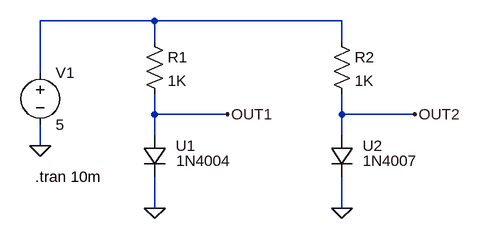
[diagram p0: schematic Diode_1N400x.asc]
Diode_1N400x.asc, the LTspice schematic file:
Version 4.1
SHEET 1 880 680
WIRE 176 80 0 80
WIRE 464 80 176 80
WIRE 176 112 176 80
WIRE 464 112 464 80
WIRE 0 160 0 80
WIRE 176 224 176 192
WIRE 288 224 176 224
WIRE 464 224 464 192
WIRE 576 224 464 224
WIRE 176 256 176 224
WIRE 464 256 464 224
WIRE 0 272 0 240
WIRE 176 368 176 320
WIRE 464 368 464 320
FLAG 176 368 0
FLAG 0 272 0
FLAG 288 224 OUT1
FLAG 464 368 0
FLAG 576 224 OUT2
SYMBOL voltage 0 144 R0
WINDOW 123 0 0 Left 0
WINDOW 39 0 0 Left 0
SYMATTR InstName V1
SYMATTR Value 5
SYMBOL res 160 96 R0
SYMATTR InstName R1
SYMATTR Value 1K
SYMBOL MyLib\\Diode\\1N4004 160 256 R0
SYMATTR InstName U1
SYMBOL res 448 96 R0
SYMATTR InstName R2
SYMATTR Value 1K
SYMBOL MyLib\\Diode\\1N4007 448 256 R0
SYMATTR InstName U2
TEXT -8 320 Left 2 !.tran 10m

The netlist it stands for:
* Diode_1N400x.asc
V1 N001 0 5
R1 N001 OUT1 1K
X§U1 OUT1 0 1N4004  ; pins + -
R2 N001 OUT2 1K
X§U2 OUT2 0 1N4007  ; pins + -
.tran 10m
.lib MyLib/Diode/1N4004.lib
.lib MyLib/Diode/1N4007.lib
.backanno
.end